# Altium project Projet solar panel.PrjPcb
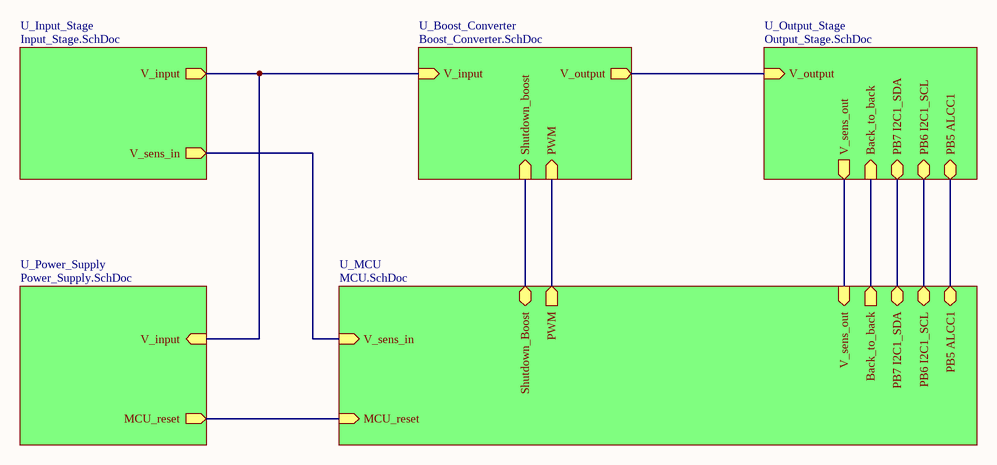
[diagram p0: Main.SchDoc]
6 sheets, 84 parts. Net scope: hierarchical (ports join the sheet entries above them; power ports are global).
Board file: PCB.PcbDoc
Sheets:
  Main.SchDoc
    U_Input_Stage = Input_Stage.SchDoc
    U_Boost_Converter = Boost_Converter.SchDoc
    U_Output_Stage = Output_Stage.SchDoc
    U_Power_Supply = Power_Supply.SchDoc
    U_MCU = MCU.SchDoc

## Sheet Main.SchDoc
size A4; SheetNumber: 1; SheetTotal: 6

### Sub-sheets
U_Boost_Converter = Boost_Converter.SchDoc: PWM (in), V_input (in), Shutdown_boost (in), V_output (out)
U_Input_Stage = Input_Stage.SchDoc: V_sens_in (out), V_input (out)
U_MCU = MCU.SchDoc: PWM (out), V_sens_in (in), Shutdown_Boost (bidir), PB6 I2C1_SCL (bidir), V_sens_out (in), PB7 I2C1_SDA (bidir), MCU_reset (in), PB5 ALCC1 (bidir), Back_to_back (out)
U_Output_Stage = Output_Stage.SchDoc: V_sens_out (out), V_output (in), PB7 I2C1_SDA (bidir), PB6 I2C1_SCL (bidir), PB5 ALCC1 (bidir), Back_to_back (in)
U_Power_Supply = Power_Supply.SchDoc: MCU_reset (out), V_input (in)  | Name: Power_Supply

### Nets
NetC4_2: sheet U_Input_Stage/V_sens_in, sheet U_MCU/V_sens_in
NetC5_1: sheet U_Input_Stage/V_input, sheet U_Boost_Converter/V_input, sheet U_Power_Supply/V_input
NetC23_2: sheet U_Output_Stage/V_sens_out, sheet U_MCU/V_sens_out
NetC24_2: sheet U_Boost_Converter/V_output, sheet U_Output_Stage/V_output
NetIC1_1: sheet U_Boost_Converter/PWM, sheet U_MCU/PWM
NetIC1_2: sheet U_Boost_Converter/Shutdown_boost, sheet U_MCU/Shutdown_Boost
NetIC5_4: sheet U_Output_Stage/PB6 I2C1_SCL, sheet U_MCU/PB6 I2C1_SCL
NetIC5_5: sheet U_Output_Stage/PB7 I2C1_SDA, sheet U_MCU/PB7 I2C1_SDA
NetIC5_6: sheet U_Output_Stage/PB5 ALCC1, sheet U_MCU/PB5 ALCC1
NetJ1_2: sheet U_Power_Supply/MCU_reset, sheet U_MCU/MCU_reset
NetP4_21: sheet U_Output_Stage/Back_to_back, sheet U_MCU/Back_to_back

## Sheet Input_Stage.SchDoc
size A4; SheetNumber: 2; SheetTotal: 6
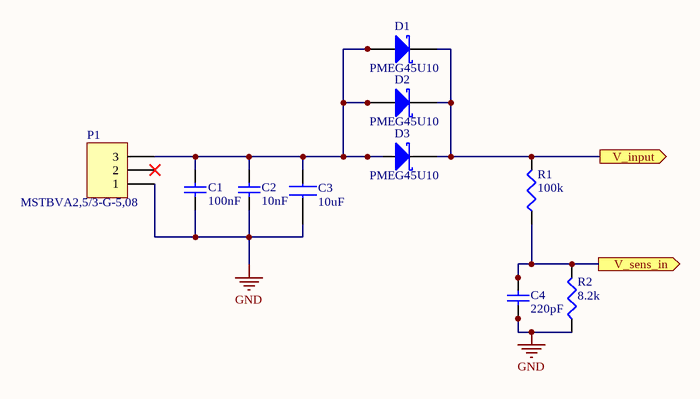
[diagram p1: Input_Stage.SchDoc]

### Parts
C1  value 100nF  [CAPC3216X180N]  (hidden comment: 10nF)
C2  value 10nF  [CAPC3216X180N]  (hidden comment: 100µF)
C3  value 10uF  [CAPC3225X270N]  (hidden comment: GRM32EC72A106KE05K)
C4  220pF  [CAPC3216X180N]
D1  PMEG45U10  [PMEG45U10EPDZ]
D2  PMEG45U10  [PMEG45U10EPDZ]
D3  PMEG45U10  [PMEG45U10EPDZ]
P1  MSTBVA2,5/3-G-5,08  [HDR1X3]
R1  value 100k  [RESC3216X75N]  (hidden comment: 100KΩ)
R2  value 8.2k  [RESC3216X75N]  (hidden comment: 8.2KΩ)

### Ports
V_input (out), V_sens_in (out)

### Nets
GND: C1.1 C2.1 C3.1 C4.1 P1.1 R2.1
NetC1_2: C1.2 C2.2 C3.2 D1.1 D1.2 D2.1 D2.2 D3.1 D3.2 P1.3
NetC4_2: C4.2 R1.1 R2.2 ; port V_sens_in
NetC5_1: D1.3 D2.3 D3.3 R1.2 ; port V_input

Not connected (* = marked no-connect by the designer): P1 2*

### Library data of the parts
C1 = CC1206KKX7R0BB104: Capacitor 100nF; Published: 8-Jun-2000; LatestRevisionDate: 17-Jul-2002; LatestRevisionNote: Re-released for DXP Platform.; PackageReference: RAD-0.3; Publisher: Altium Limited; PackageDescription: Radial Cap, Thru-Hole; 2 Leads; 0.3 in Pin Spacing; Supplier 1: Farnell
C2 = C1206C103K1RACTU: Capacitor 10nF; Published: 8-Jun-2000; LatestRevisionDate: 17-Jul-2002; LatestRevisionNote: Re-released for DXP Platform.; PackageReference: RAD-0.3; Publisher: Altium Limited; PackageDescription: Radial Cap, Thru-Hole; 2 Leads; 0.3 in Pin Spacing; Supplier 1: Mouser
C3 = GRM32EC72A106KE05K: Ceramic capacitor 10uF; Manufacturer_Name: Murata Electronics; Height: 2.7mm; Manufacturer_Part_Number: GRM32EC72A106KE05K; Mouser Part Number: 81-GRM32EC72A106KE5K; Mouser Price/Stock: https://www.mouser.co.uk/ProductDetail/Murata-Electronics/GRM32EC72A106KE05K?qs=rrS6PyfT74e65RehvwNPbw%3D%3D; Arrow Part Number: GRM32EC72A106KE05K; Arrow Price/Stock: https://www.arrow.com/en/products/grm32ec72a106ke05k/murata-manufacturing?region=nac
C4 = VJ1206A221JXBCW1BC: Capacitor 220pF; Published: 8-Jun-2000; LatestRevisionDate: 17-Jul-2002; LatestRevisionNote: Re-released for DXP Platform.; PackageReference: RAD-0.3; Publisher: Altium Limited; PackageDescription: Radial Cap, Thru-Hole; 2 Leads; 0.3 in Pin Spacing; Supplier 1: Mouser; Value: 220pF
D1-D3 = PMEG45U10EPDZ: Schottky Diode; Manufacturer_Name: Nexperia; Datasheet Link: https://assets.nexperia.com/documents/data-sheet/PMEG45U10EPD.pdf; Height: 0.82mm; Manufacturer_Part_Number: PMEG45U10EPDZ; Mouser Part Number: 771-PMEG45U10EPDZ; Mouser Price/Stock: https://www.mouser.co.uk/ProductDetail/Nexperia/PMEG45U10EPDZ?qs=M%2FOdCRO8QQ0v3Dd16sTKSg%3D%3D; Arrow Part Number: PMEG45U10EPDZ; Arrow Price/Stock: https://www.arrow.com/en/products/pmeg45u10epdz/nexperia
P1 = MSTBVA2,5/3-G-5,08: Header, 3-Pin; LatestRevisionDate: 17-Jul-2002; LatestRevisionNote: Re-released for DXP Platform.; Publisher: Altium Limited
R1 = MCWR12X1003FTL: Resistor 100k; Published: 8-Jun-2000; LatestRevisionDate: 29-May-2009; LatestRevisionNote: IPC-7351 Footprint Added.; PackageReference: J1-0603; Publisher: Altium Limited; PackageDescription: Chip Resistor; Supplier 1: Farnell
R2 = CRGCQ1206F8K2: Resistor 8.2k; Published: 8-Jun-2000; LatestRevisionDate: 29-May-2009; LatestRevisionNote: IPC-7351 Footprint Added.; PackageReference: J1-0603; Publisher: Altium Limited; PackageDescription: Chip Resistor; Supplier 1: Mouser

## Sheet Boost_Converter.SchDoc
size A4; SheetNumber: 3; SheetTotal: 6
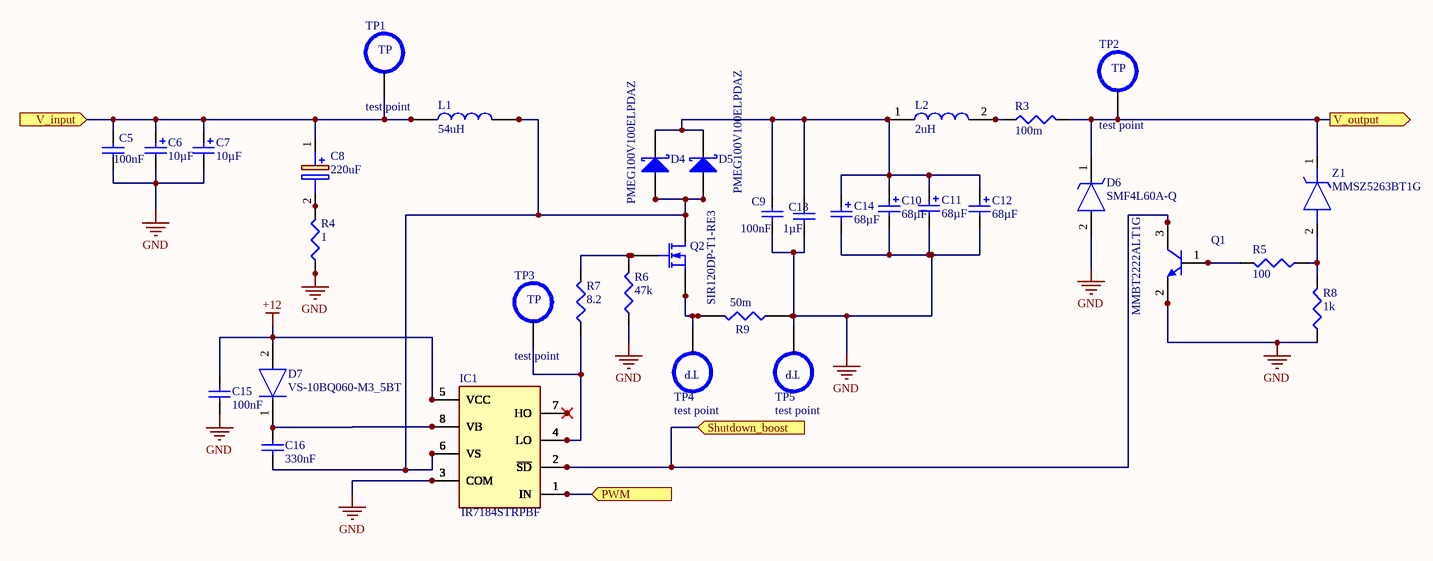
[diagram p2: Boost_Converter.SchDoc]

### Parts
C5  value 100nF  [CAPC3216X180N]  (hidden comment: CC1206KKX7R0BB104)
C6  value 10µF  [870056174001]  (hidden comment: 870056174001)
C7  value 10µF  [870056174001]  (hidden comment: 870056174001)
C8  value 220uF  [CAPPRD500W60D1275H2700]  (hidden comment: 100ZLJ220M12.5X25)
C9  value 100nF  [CAPC3216X180N]  (hidden comment: CC1206KKX7R0BB104)
C10  EGXF251ELL680MK30S: 68µF  [EGXF251ELL680MK30S]  (hidden comment: EGXF251ELL680MK30S)
C11  EGXF251ELL680MK30S: 68µF  [EGXF251ELL680MK30S]  (hidden comment: EGXF251ELL680MK30S)
C12  EGXF251ELL680MK30S: 68µF  [EGXF251ELL680MK30S]  (hidden comment: EGXF251ELL680MK30S)
C13  value 1µF  [CAPC3216X180N]  (hidden comment: C1206C105M5REC7210)
C14  EGXF251ELL680MK30S: 68µF  [EGXF251ELL680MK30S]  (hidden comment: EGXF251ELL680MK30S)
C15  100nF  [CAPC3216X180N]
C16  330nF  [CAPC3216X180N]
D4  PMEG100V100ELPDAZ  [PMEG100V100ELPDAZ]
D5  PMEG100V100ELPDAZ  [PMEG100V100ELPDAZ]
D6  SMF4L60A-Q  [SODFL3716X135N]
D7  VS-10BQ060-M3_5BT  [DIOM5436X244N]
IC1  IR7184STRPBF  [SOIC127P600X175-8N]
L1  value 54uH  [SHBC201R7A0054V]  (hidden comment: SHBC20-1R7A0054V)
L2  value 2uH  [SRP1510CA100M]  (hidden comment: SRP1580CA-2R0M)
Q1  MMBT2222ALT1G  [SOT96P237X111-3N]
Q2  SIR120DP-T1-RE3  [SI7141DPT1GE3]
R3  value 100m  [RESC6331X80N]  (hidden comment: CRM2512-FX-R100ELF)
R4  value 1  [RESC6432X120N]  (hidden comment: 35221R0JT)
R5  value 100  [RESC3216X75N]  (hidden comment: 100Ω)
R6  value 47k  [RESC3216X75N]  (hidden comment: MCWR12X4702FTL)
R7  value 8.2  [RESC3216X75N]  (hidden comment: MCWR12W8R20FTL)
R8  value 1k  [RESC3216X75N]  (hidden comment: 1KΩ)
R9  value 50m  [RESC7146X175N]  (hidden comment: WSHM2818R0500FEB)
TP1  test point  [Test point]
TP2  test point  [Test point]
TP3  test point  [Test point]
TP4  test point  [Test point]
TP5  test point  [Test point]
Z1  MMSZ5263BT1G  [SOD3716X135N]

### Ports
PWM (in), Shutdown_boost (in), V_input (in), V_output (out)

### Nets
+12: C15.2 D7.2(A) IC1.5(VCC)
GND: C5.2 C6.2 C7.2 C9.2 C10.2 C11.2 C12.2 C13.1 C14.2 C15.1 D6.2(A) IC1.3(COM) Q1.2(E) R4.1 R6.1 R8.1 R9.1 TP5.5
NetC5_1: C5.1 C6.1 C7.1 C8.1(+) L1.1 TP1.5 ; port V_input
NetC8_2: C8.2(-) R4.2
NetC9_1: C9.1 C10.1 C11.1 C12.1 C13.2 C14.1 D4.3(K) D5.3(K) L2.1
NetC16_1: C16.1 D4.1(A_1) D4.2(A_2) D5.1(A_1) D5.2(A_2) IC1.6(VS) L1.2 Q2.5(D) Q2.6(D) Q2.7(D) Q2.8(D)
NetC16_2: C16.2 D7.1(K) IC1.8(VB)
NetC24_2: D6.1(K) R3.2 TP2.5 Z1.1(K) ; port V_output
NetIC1_1: IC1.1(IN) ; port PWM
NetIC1_2: IC1.2(~{SD}) Q1.3(C) ; port Shutdown_boost
NetIC1_4: IC1.4(LO) R7.1 TP3.5
NetL2_2: L2.2 R3.1
NetQ1_1: Q1.1(B) R5.2
NetQ2_1: Q2.1(G) R6.2 R7.2
NetQ2_2: Q2.2(S) Q2.3(S) Q2.4(S) R9.2 TP4.5
NetR5_1: R5.1 R8.2 Z1.2(A)

Not connected (* = marked no-connect by the designer): IC1 7(HO)*

### Notes on the sheet
- (in symbol test point) TP

### Library data of the parts
C5 C9 C15 = CC1206KKX7R0BB104: Capacitor 100nF; Published: 8-Jun-2000; LatestRevisionDate: 17-Jul-2002; LatestRevisionNote: Re-released for DXP Platform.; PackageReference: RAD-0.3; Publisher: Altium Limited; PackageDescription: Radial Cap, Thru-Hole; 2 Leads; 0.3 in Pin Spacing; Supplier 1: Farnell
  C15: Value: 100nF
C6 C7 = 870056174001: Capacitor Polarised 10uF; Manufacturer_Name: Panasonic; Manufacturer_Part_Number: EEV-FK1K101V; Datasheet Link: http://industrial.panasonic.com/cdbs/www-data/pdf/RDE0000/ABA0000C1181.pdf; Height: 14.3mm; Mouser Part Number: 667-EEV-FK1K101V; Mouser Price/Stock: https://www.mouser.co.uk/ProductDetail/Panasonic/EEV-FK1K101V?qs=MtOUKumLmnbTFvRMlB7%2FdA%3D%3D
C8 = 100ZLJ220M12.5X25: Capacitor Polarised; Manufacturer_Name: Rubycon; Datasheet Link: https://componentsearchengine.com/Datasheets/2/100ZLJ220M12.5X25.pdf; Height: 27mm; Manufacturer_Part_Number: 100ZLJ220M12.5X25; Mouser Part Number: 232-100ZLJ220M125X25; Mouser Price/Stock: https://www.mouser.com/Search/Refine.aspx?Keyword=232-100ZLJ220M125X25; Arrow Part Number: 100ZLJ220M12.5X25; Arrow Price/Stock: https://www.arrow.com/en/products/100zlj220m12.5x25/rubycon
C10-C12 C14 = EGXF251ELL680MK30S: Capacitor 68uF; Manufacturer_Name: Panasonic; Manufacturer_Part_Number: EEV-FK1K101V; Value: 68µF; Datasheet Link: http://industrial.panasonic.com/cdbs/www-data/pdf/RDE0000/ABA0000C1181.pdf; Height: 14.3mm; Mouser Part Number: 667-EEV-FK1K101V; Mouser Price/Stock: https://www.mouser.co.uk/ProductDetail/Panasonic/EEV-FK1K101V?qs=MtOUKumLmnbTFvRMlB7%2FdA%3D%3D
C13 = C1206C105M5REC7210: Capacitor 1uF; Published: 8-Jun-2000; LatestRevisionDate: 17-Jul-2002; LatestRevisionNote: Re-released for DXP Platform.; PackageReference: RAD-0.3; Publisher: Altium Limited; PackageDescription: Radial Cap, Thru-Hole; 2 Leads; 0.3 in Pin Spacing; Supplier 1: Farnell
C16 = C3216X7R2A334K130AA: Capacitor 330nF; Published: 8-Jun-2000; LatestRevisionDate: 17-Jul-2002; LatestRevisionNote: Re-released for DXP Platform.; PackageReference: RAD-0.3; Publisher: Altium Limited; PackageDescription: Radial Cap, Thru-Hole; 2 Leads; 0.3 in Pin Spacing; Supplier 1: Mouser; Value: 330nF
D4 D5 = PMEG100V100ELPDAZ: Diode; Manufacturer_Name: Nexperia; Datasheet Link: https://assets.nexperia.com/documents/data-sheet/PMEG100V100ELPD.pdf; Height: 0.82mm; Manufacturer_Part_Number: PMEG100V100ELPDAZ; Mouser Part Number: 771-MEG100V100ELPDAZ; Mouser Price/Stock: https://www.mouser.co.uk/ProductDetail/Nexperia/PMEG100V100ELPDAZ?qs=64Y9EYqwa9iK90zZrx4xYg%3D%3D; Arrow Part Number: PMEG100V100ELPDAZ; Arrow Price/Stock: https://www.arrow.com/en/products/pmeg100v100elpdaz/nexperia
D6 = SMF4L60A-Q: TVS Diode (Uni-directional); Manufacturer_Name: Bourns; Datasheet Link: https://bourns.com/docs/product-datasheets/smf4l-q.pdf; Height: 1.35mm; Manufacturer_Part_Number: SMF4L60A-Q; Mouser Part Number: 652-SMF4L60A-Q; Mouser Price/Stock: https://www.mouser.co.uk/ProductDetail/Bourns/SMF4L60A-Q?qs=iLbezkQI%252BsjmazDMS%252BOglQ%3D%3D
D7 = VS-10BQ060-M3_5BT: Diode; Manufacturer_Name: Vishay; Manufacturer_Part_Number: VS-10BQ060-M3/5BT; Datasheet Link: https://componentsearchengine.com/Datasheets/1/VS-10BQ060-M3_5BT.pdf; Height: 2.44mm; Mouser Part Number: 78-VS-10BQ060-M35BT; Mouser Price/Stock: https://www.mouser.co.uk/ProductDetail/Vishay-Semiconductors/VS-10BQ060-M3-5BT/?qs=asPD7ZL2j3Xpjq4X%2F1O06Q%3D%3D; Arrow Part Number: VS-10BQ060-M3/5BT; Arrow Price/Stock: https://www.arrow.com/en/products/vs-10bq060-m35bt/vishay
IC1 = IR7184STRPBF: Integrated Circuit; Manufacturer_Name: Infineon; Datasheet Link: https://componentsearchengine.com/Datasheets/1/IR7184STRPBF.pdf; Height: 1.75mm; Manufacturer_Part_Number: IR7184STRPBF; Mouser Part Number: 942-IR7184STRPBF; Mouser Price/Stock: https://www.mouser.com/Search/Refine.aspx?Keyword=942-IR7184STRPBF; Arrow Part Number: IR7184STRPBF; Arrow Price/Stock: https://www.arrow.com/en/products/ir7184strpbf/infineon-technologies-ag
L1 = SHBC20-1R7A0054V: Inductor 54uH
L2 = SRP1580CA-2R0M: Inductor 2uH; Manufacturer_Name: Bourns; Manufacturer_Part_Number: SRP1038C-100M; Datasheet Link: https://www.bourns.com/data/global/pdfs/SRP1038A.pdf; Height: 4mm; Mouser Part Number: 652-SRP1038C-100M; Mouser Price/Stock: https://www.mouser.co.uk/ProductDetail/Bourns/SRP1038C-100M?qs=PzGy0jfpSMvAa%252BP05u%252BK2w%3D%3D; Arrow Part Number: SRP1038C-100M; Arrow Price/Stock: https://www.arrow.com/en/products/srp1038c-100m/bourns
Q1 = MMBT2222ALT1G: NPN transistor; Manufacturer_Name: ON Semiconductor; Datasheet Link: http://www.onsemi.com/pub/Collateral/MMBT2222LT1-D.PDF; Height: 1.11mm; Manufacturer_Part_Number: MMBT2222ALT1G; Mouser Part Number: 863-MMBT2222ALT1G; Mouser Price/Stock: https://www.mouser.co.uk/ProductDetail/onsemi/MMBT2222ALT1G?qs=HVbQlW5zcXWwnD7Jokybqg%3D%3D; Arrow Part Number: MMBT2222ALT1G; Arrow Price/Stock: https://www.arrow.com/en/products/mmbt2222alt1g/on-semiconductor
Q2 = SIR120DP-T1-RE3: MOSFET (N-Channel); Manufacturer_Name: Vishay; Datasheet Link: http://www.vishay.com/docs/79731/sir120dp.pdf; Manufacturer_Part_Number: SIR120DP-T1-RE3; Mouser Part Number: 78-SIR120DP-T1-RE3; Mouser Price/Stock: https://www.mouser.co.uk/ProductDetail/Vishay-Semiconductors/SIR120DP-T1-RE3?qs=UkDUCjYnTB3xEXzKpvDZuA%3D%3D; Arrow Part Number: SIR120DP-T1-RE3; Arrow Price/Stock: https://www.arrow.com/en/products/sir120dp-t1-re3/vishay
R3 = CRM2512-FX-R100ELF: Resistor 100m; Published: 8-Jun-2000; LatestRevisionDate: 29-May-2009; LatestRevisionNote: IPC-7351 Footprint Added.; PackageReference: J1-0603; Publisher: Altium Limited; PackageDescription: Chip Resistor; Supplier 1: Mouser
R4 = 35221R0JT: Resistor 1 3W; Published: 8-Jun-2000; LatestRevisionDate: 29-May-2009; LatestRevisionNote: IPC-7351 Footprint Added.; PackageReference: J1-0603; Publisher: Altium Limited; PackageDescription: Chip Resistor; Supplier 1: Farnell
R5 = MCWR12X1000FTL: Resistor 100; Published: 8-Jun-2000; LatestRevisionDate: 29-May-2009; LatestRevisionNote: IPC-7351 Footprint Added.; PackageReference: J1-0603; Publisher: Altium Limited; PackageDescription: Chip Resistor; Supplier 1: Farnell
R6 = MCWR12X4702FTL: Resistor 47k; Published: 8-Jun-2000; LatestRevisionDate: 29-May-2009; LatestRevisionNote: IPC-7351 Footprint Added.; PackageReference: J1-0603; Publisher: Altium Limited; PackageDescription: Chip Resistor; supplier: farnell
R7 = MCWR12W8R20FTL: Resistor 8.2; Published: 8-Jun-2000; LatestRevisionDate: 29-May-2009; LatestRevisionNote: IPC-7351 Footprint Added.; PackageReference: J1-0603; Publisher: Altium Limited; PackageDescription: Chip Resistor; Supplier 1: Farnell
R8 = MCHP06W2F1001T5E: Resistor 1k; Published: 8-Jun-2000; LatestRevisionDate: 29-May-2009; LatestRevisionNote: IPC-7351 Footprint Added.; PackageReference: J1-0603; Publisher: Altium Limited; PackageDescription: Chip Resistor; supplier: farnell; Supplier 1: Farnell
R9 = WSHM2818R0500FEB: Resistor 50m; Manufacturer_Name: Vishay; Datasheet Link: https://componentsearchengine.com/Datasheets/2/WSHM2818R0500FEB.pdf; Height: 1.75mm; Manufacturer_Part_Number: WSHM2818R0500FEB; Mouser Part Number: 71-WSHM2818R0500FEB; Mouser Price/Stock: https://www.mouser.com/Search/Refine.aspx?Keyword=71-WSHM2818R0500FEB
Z1 = MMSZ5263BT1G: Zener Diode; Manufacturer_Name: ON Semiconductor; Datasheet Link: http://www.onsemi.com/pub/Collateral/MMSZ5221BT1-D.PDF; Height: 1.35mm; Manufacturer_Part_Number: MMSZ5263BT1G; Mouser Part Number: 863-MMSZ5263BT1G; Mouser Price/Stock: https://www.mouser.co.uk/ProductDetail/onsemi/MMSZ5263BT1G?qs=ZpPixqFcBtxaamSEBIiIIg%3D%3D; Arrow Part Number: MMSZ5263BT1G; Arrow Price/Stock: https://www.arrow.com/en/products/mmsz5263bt1g/on-semiconductor?region=nac

## Sheet Output_Stage.SchDoc
size A4; SheetNumber: 5; SheetTotal: 6
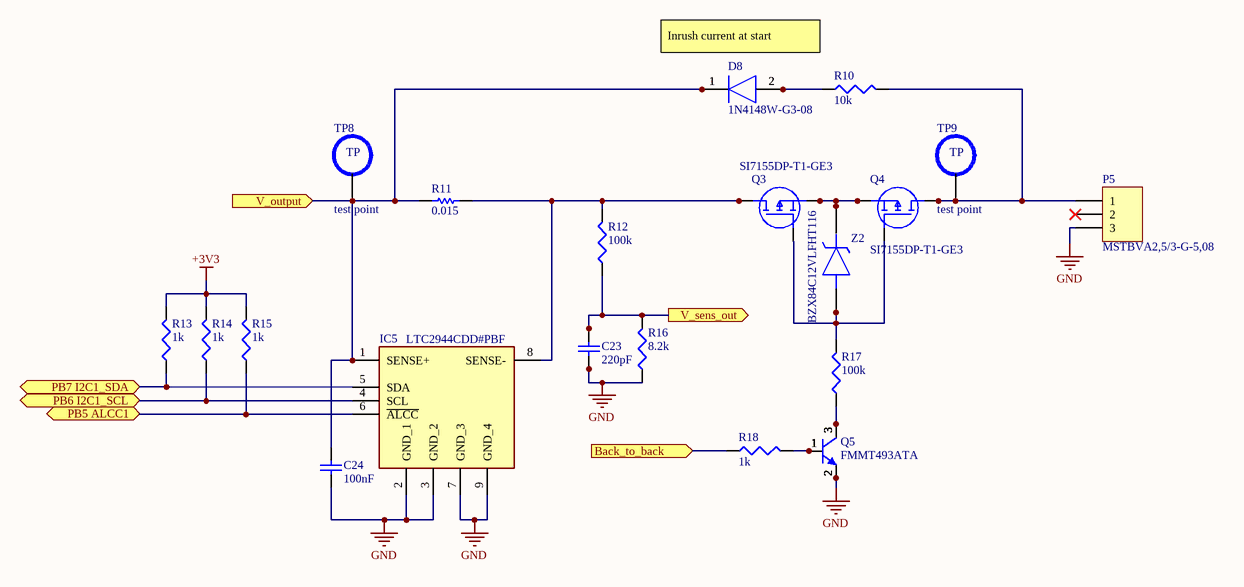
[diagram p3: Output_Stage.SchDoc]

### Parts
C23  220pF  [CAPC3216X180N]
C24  value 100nF  [CAPC3216X180N]  (hidden comment: CC1206KKX7R0BB104)
D8  1N4148W-G3-08  [SOD3716X135N]
IC5  LTC2944CDD#PBF  [SON50P300X300X80-9N-D]
P5  MSTBVA2,5/3-G-5,08  [HDR1X3]
Q3  SI7155DP-T1-GE3  [SI7141DPT1GE3]
Q4  SI7155DP-T1-GE3  [SI7141DPT1GE3]
Q5  FMMT493ATA  [SOT95P230X110-3N]
R10  value 10k  [RESC3216X75N]  (hidden comment: MCWR12X1002FTL)
R11  value 0.015  [RESC3216X75N]  (hidden comment: ERJ8BWFR015V)
R12  value 100k  [RESC3216X75N]  (hidden comment: 100KΩ)
R13  value 1k  [RESC3216X75N]  (hidden comment: MCHP06W2F1001T5E)
R14  value 1k  [RESC3216X75N]  (hidden comment: MCHP06W2F1001T5E)
R15  value 1k  [RESC3216X75N]  (hidden comment: MCHP06W2F1001T5E)
R16  value 8.2k  [RESC3216X75N]  (hidden comment: 8.2KΩ)
R17  value 100k  [RESC3216X75N]  (hidden comment: MCWR12X1003FTL)
R18  value 1k  [RESC3216X75N]  (hidden comment: MCHP06W2F1001T5E)
TP8  test point  [Test point]
TP9  test point  [Test point]
Z2  BZX84C12VLFHT116  [SOT95P240X115-3N]

### Ports
Back_to_back (in), PB5 ALCC1 (bidir), PB6 I2C1_SCL (bidir), PB7 I2C1_SDA (bidir), V_output (in), V_sens_out (out)

### Nets
+3V3: R13.2 R14.2 R15.2
GND: C23.1 C24.1 IC5.2(GND_1) IC5.3(GND_2) IC5.7(GND_3) IC5.9(GND_4) P5.3 Q5.2(E) R16.1
NetC23_2: C23.2 R12.1 R16.2 ; port V_sens_out
NetC24_2: C24.2 D8.1(K) IC5.1(SENSE+) R11.1 TP8.5 ; port V_output
NetD8_2: D8.2(A) R10.1
NetIC5_4: IC5.4(SCL) R14.1 ; port PB6 I2C1_SCL
NetIC5_5: IC5.5(SDA) R13.1 ; port PB7 I2C1_SDA
NetIC5_6: IC5.6(~{ALCC}) R15.1 ; port PB5 ALCC1
NetIC5_8: IC5.8(SENSE-) Q3.5(D) Q3.6(D) Q3.7(D) Q3.8(D) R11.2 R12.2
NetP4_21: R18.1 ; port Back_to_back
NetP5_1: P5.1 Q4.5(D) Q4.6(D) Q4.7(D) Q4.8(D) R10.2 TP9.5
NetQ3_1: Q3.1(G) Q4.1(G) R17.2 Z2.1(A) Z2.2(A)
NetQ3_2: Q3.2(S) Q3.3(S) Q3.4(S) Q4.2(S) Q4.3(S) Q4.4(S) Z2.3(K)
NetQ5_1: Q5.1(B) R18.2
NetQ5_3: Q5.3(C) R17.1

Not connected (* = marked no-connect by the designer): P5 2*

### Notes on the sheet
- Inrush current at start
- (in symbol test point) TP

### Library data of the parts
C23 = VJ1206A221JXBCW1BC: Capacitor 220pF; Published: 8-Jun-2000; LatestRevisionDate: 17-Jul-2002; LatestRevisionNote: Re-released for DXP Platform.; PackageReference: RAD-0.3; Publisher: Altium Limited; PackageDescription: Radial Cap, Thru-Hole; 2 Leads; 0.3 in Pin Spacing; Supplier 1: Mouser; Value: 220pF
C24 = CC1206KKX7R0BB104: Capacitor 100nF; Published: 8-Jun-2000; LatestRevisionDate: 17-Jul-2002; LatestRevisionNote: Re-released for DXP Platform.; PackageReference: RAD-0.3; Publisher: Altium Limited; PackageDescription: Radial Cap, Thru-Hole; 2 Leads; 0.3 in Pin Spacing; Supplier 1: Farnell
D8 = 1N4148W-G3-08: Diode; Manufacturer_Name: Vishay; Datasheet Link: https://componentsearchengine.com/Datasheets/1/1N4148W-G3-08.pdf; Height: 1.35mm; Manufacturer_Part_Number: 1N4148W-G3-08; Mouser Part Number: 78-1N4148W-G3-08; Mouser Price/Stock: https://www.mouser.co.uk/ProductDetail/Vishay-Semiconductors/1N4148W-G3-08?qs=uS%252BVSIFnvp46StDBB15x4Q%3D%3D; Arrow Part Number: 1N4148W-G3-08; Arrow Price/Stock: https://www.arrow.com/en/products/1n4148w-g3-08/vishay
IC5 = LTC2944CDD#PBF: Integrated Circuit; Manufacturer_Name: Analog Devices; Datasheet Link: https://www.analog.com/media/en/technical-documentation/data-sheets/2944fa.pdf; Height: 0.8mm; Manufacturer_Part_Number: LTC2944CDD#PBF; Mouser Part Number: 584-LTC2944CDDPBF; Mouser Price/Stock: https://www.mouser.co.uk/ProductDetail/Analog-Devices/LTC2944CDDPBF?qs=u4fy%2FsgLU9Omd44j%252B6inEQ%3D%3D; Arrow Part Number: LTC2944CDD#PBF; Arrow Price/Stock: https://www.arrow.com/en/products/ltc2944cddpbf/analog-devices
P5 = MSTBVA2,5/3-G-5,08: Header, 3-Pin; LatestRevisionDate: 17-Jul-2002; LatestRevisionNote: Re-released for DXP Platform.; Publisher: Altium Limited
Q3 Q4 = SI7155DP-T1-GE3: MOSFET (P-Channel)
Q5 = FMMT493ATA: Transistor BJT PNP; Manufacturer_Name: Diodes Inc.; Datasheet Link: https://datasheet.datasheetarchive.com/originals/distributors/Datasheets_SAMA/813f9dcbae48594177f25ecf9038d058.pdf; Height: 1.1mm; Manufacturer_Part_Number: FMMT493ATA; Mouser Part Number: 522-FMMT493ATA; Mouser Price/Stock: https://www.mouser.co.uk/ProductDetail/Diodes-Incorporated/FMMT493ATA?qs=GBLSl2AkiruoD9OMdIH%252BaQ%3D%3D; Arrow Part Number: FMMT493ATA; Arrow Price/Stock: https://www.arrow.com/en/products/fmmt493ata/diodes-incorporated
R10 = MCWR12X1002FTL: Resistor 10k; Published: 8-Jun-2000; LatestRevisionDate: 29-May-2009; LatestRevisionNote: IPC-7351 Footprint Added.; PackageReference: J1-0603; Publisher: Altium Limited; PackageDescription: Chip Resistor; Supplier 1: Farnell
R11 = ERJ8BWFR015V: Shunt resistor 0.015; Published: 8-Jun-2000; LatestRevisionDate: 17-Jul-2002; LatestRevisionNote: Re-released for DXP Platform.; PackageReference: AXIAL-0.3; Publisher: Altium Limited; PackageDescription: Axial Device, Thru-Hole; 2 Leads; 0.3 in Pin Spacing; Supplier 1: Mouser
R12 R17 = MCWR12X1003FTL: Resistor 100k; Published: 8-Jun-2000; LatestRevisionDate: 29-May-2009; LatestRevisionNote: IPC-7351 Footprint Added.; PackageReference: J1-0603; Publisher: Altium Limited; PackageDescription: Chip Resistor; Supplier 1: Farnell
R13-R15 R18 = MCHP06W2F1001T5E: Resistor 1k; Published: 8-Jun-2000; LatestRevisionDate: 29-May-2009; LatestRevisionNote: IPC-7351 Footprint Added.; PackageReference: J1-0603; Publisher: Altium Limited; PackageDescription: Chip Resistor; supplier: farnell; Supplier 1: Farnell
R16 = CRGCQ1206F8K2: Resistor 8.2k; Published: 8-Jun-2000; LatestRevisionDate: 29-May-2009; LatestRevisionNote: IPC-7351 Footprint Added.; PackageReference: J1-0603; Publisher: Altium Limited; PackageDescription: Chip Resistor; Supplier 1: Mouser
Z2 = BZX84C12VLFHT116: Zener Diode

## Sheet Power_Supply.SchDoc
size A4; SheetNumber: 4; SheetTotal: 6
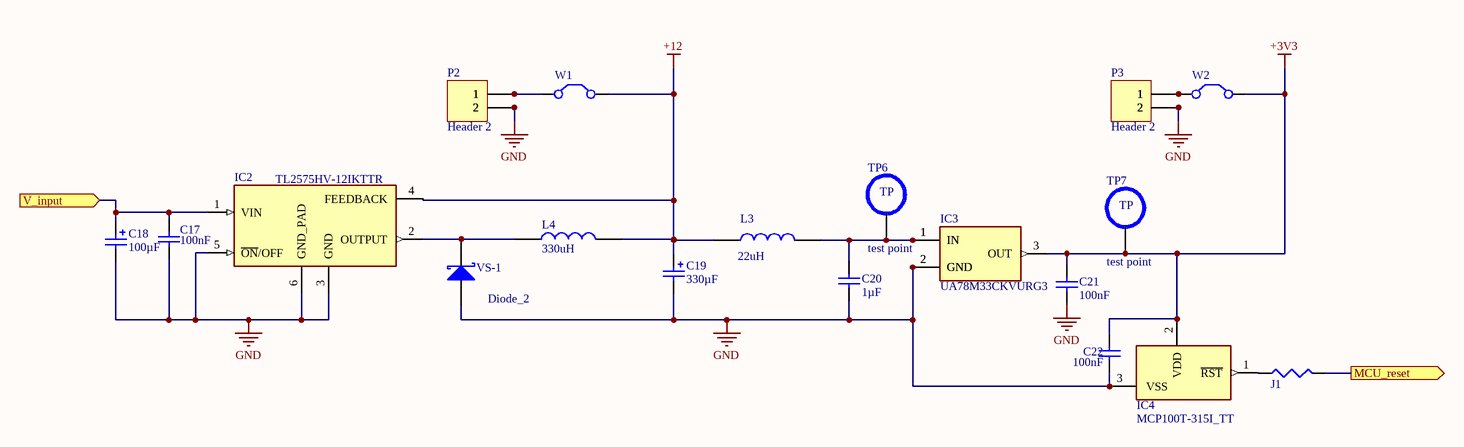
[diagram p4: Power_Supply.SchDoc]

### Parts
C17  value 100nF  [CAPC3216X180N]  (hidden comment: CC1206KKX7R0BB104)
C18  value 100µF  [EEEFK0J332AV]  (hidden comment: EEV-FK1K101V)
C19  value 330µF  [EEE0JA471UAP]  (hidden comment: EEEFK1E331P)
C20  value 1µF  [CAPC3216X180N]  (hidden comment: C1206C105M5REC7210)
C21  value 100nF  [CAPC3216X180N]  (hidden comment: CC1206KKX7R0BB104)
C22  value 100nF  [CAPC3216X180N]  (hidden comment: CC1206KKX7R0BB104)
IC2  TL2575HV-12IKTTR  [TO170P1524X483-6N]
IC3  UA78M33CKVURG3  [TPS7A6533QKVURQ1]
IC4  MCP100T-315I_TT  [SOT96P237X112-3N]
J1  MCWR12X000 PTL  [RESC3216X75N]  (value not drawn)
L3  22uH  [INDPM6965X300N]
L4  330uH  [WE-PD_7332/7345_PLASTIC_BASE54]
P2  Header 2  [HDR1X2]
P3  Header 2  [HDR1X2]
TP6  test point  [Test point]
TP7  test point  [Test point]
VS-1  Diode_2  [DIOM5436X244N]
W1  Jumper  [RAD-0.2]  (value not drawn)
W2  Jumper  [RAD-0.2]  (value not drawn)

### Ports
MCU_reset (out), V_input (in)

### Nets
+3V3: C21.2 C22.2 IC3.3(OUT) IC4.2(VDD) TP7.5 W2.2(C2)
+12: C19.1 IC2.4(FEEDBACK) L3.1 L4.2 W1.2(C2)
GND: C17.1 C18.2 C19.2 C20.1 C21.1 C22.1 IC2.3(GND) IC2.5(~{ON}/OFF) IC2.6(GND_PAD) IC3.2(GND) IC4.3(VSS) P2.2 P3.2 VS-1.2(A)
NetC5_1: C17.2 C18.1 IC2.1(VIN) ; port V_input
NetC20_2: C20.2 IC3.1(IN) L3.2 TP6.5
NetIC2_2: IC2.2(OUTPUT) L4.1 VS-1.1(K)
NetIC4_1: IC4.1(~{RST}) J1.1
NetJ1_2: J1.2 ; port MCU_reset
NetP2_1: P2.1 W1.1(C1)
NetP3_1: P3.1 W2.1(C1)

### Notes on the sheet
- (in symbol test point) TP

### Library data of the parts
C17 C21 C22 = CC1206KKX7R0BB104: Capacitor 100nF; Published: 8-Jun-2000; LatestRevisionDate: 17-Jul-2002; LatestRevisionNote: Re-released for DXP Platform.; PackageReference: RAD-0.3; Publisher: Altium Limited; PackageDescription: Radial Cap, Thru-Hole; 2 Leads; 0.3 in Pin Spacing; Supplier 1: Farnell
C18 = EEV-FK1K101V: Capacitor 100uF; Manufacturer_Name: Panasonic; Datasheet Link: http://industrial.panasonic.com/cdbs/www-data/pdf/RDE0000/ABA0000C1181.pdf; Height: 14.3mm; Manufacturer_Part_Number: EEV-FK1K101V; Mouser Part Number: 667-EEV-FK1K101V; Mouser Price/Stock: https://www.mouser.co.uk/ProductDetail/Panasonic/EEV-FK1K101V?qs=MtOUKumLmnbTFvRMlB7%2FdA%3D%3D; Supplier 1: Mouser
C19 = EEEFK1E331P: Capacitor 330uF; Manufacturer_Name: Panasonic; Manufacturer_Part_Number: EEV-FK1K101V; Datasheet Link: http://industrial.panasonic.com/cdbs/www-data/pdf/RDE0000/ABA0000C1181.pdf; Height: 14.3mm; Mouser Part Number: 667-EEV-FK1K101V; Mouser Price/Stock: https://www.mouser.co.uk/ProductDetail/Panasonic/EEV-FK1K101V?qs=MtOUKumLmnbTFvRMlB7%2FdA%3D%3D; Supplier 1: Mouser
C20 = C1206C105M5REC7210: Capacitor 1uF; Published: 8-Jun-2000; LatestRevisionDate: 17-Jul-2002; LatestRevisionNote: Re-released for DXP Platform.; PackageReference: RAD-0.3; Publisher: Altium Limited; PackageDescription: Radial Cap, Thru-Hole; 2 Leads; 0.3 in Pin Spacing; Supplier 1: Farnell
IC2 = TL2575HV-12IKTTR: Integrated Circuit; Manufacturer_Name: Texas Instruments; Datasheet Link: http://www.ti.com/lit/ds/symlink/tl2575-15.pdf; Height: 5.13mm; Manufacturer_Part_Number: TL2575HV-12IKTTR; Mouser Part Number: 595-TL2575HV-12IKTTR; Mouser Price/Stock: https://www.mouser.co.uk/ProductDetail/Texas-Instruments/TL2575HV-12IKTTR?qs=EnLMdcWnKADDmW7d51Om1g%3D%3D; Arrow Part Number: TL2575HV-12IKTTR; Arrow Price/Stock: https://www.arrow.com/en/products/tl2575hv-12ikttr/texas-instruments?region=nac
IC3 = UA78M33CKVURG3: Integrated Circuit; Manufacturer_Name: Texas Instruments; Datasheet Link: https://www.ti.com/lit/gpn/ua78m?HQS=ti-null-null-sf-df-pf-sep-wwe&DCM=yes; Height: 2.52mm; Manufacturer_Part_Number: UA78M33CKVURG3; Mouser Part Number: 595-UA78M33CKVURG3; Mouser Price/Stock: https://www.mouser.co.uk/ProductDetail/Texas-Instruments/UA78M33CKVURG3?qs=0O%2FZFlpUpJXrDg4gfD1Q2g%3D%3D; Arrow Part Number: UA78M33CKVURG3; Arrow Price/Stock: https://www.arrow.com/en/products/ua78m33ckvurg3/texas-instruments
IC4 = MCP100T-315I_TT: Integrated Circuit; Manufacturer_Name: Microchip; Manufacturer_Part_Number: MCP100T-315I/TT; Datasheet Link: http://docs-emea.rs-online.com/webdocs/0d03/0900766b80d034b8.pdf; Height: 1.12mm; Mouser Part Number: 579-MCP100T-315I/TT; Mouser Price/Stock: https://www.mouser.co.uk/ProductDetail/Microchip-Technology/MCP100T-315I-TT?qs=cQYLKLPzRJnnE4Sa6znIFg%3D%3D; Arrow Part Number: MCP100T-315I/TT; Arrow Price/Stock: https://www.arrow.com/en/products/mcp100t-315itt/microchip-technology?region=nac
J1 = MCWR12X000 PTL: Zero ohm resistor; Value: 0
L3 = IHLP2525CZER220M11: Inductor 22uH; Manufacturer_Name: Vishay; Datasheet Link: https://componentsearchengine.com/Datasheets/1/IHLP2525CZER220M11.pdf; Height: 3mm; Manufacturer_Part_Number: IHLP2525CZER220M11; Mouser Part Number: 70-IHLP2525CZER220; Mouser Price/Stock: https://www.mouser.co.uk/ProductDetail/Vishay-Dale/IHLP2525CZER220M11?qs=sy7P%252B1cA09hqmhD2Kelr6g%3D%3D; Arrow Part Number: IHLP2525CZER220M11; Arrow Price/Stock: https://www.arrow.com/en/products/ihlp2525czer220m11/vishay?region=europe; Value: 22uH
L4 = 7447789233: Inductor 330uH; Manufacturer_Name: Wurth Elektronik; Manufacturer_Part_Number: 7447789233
P2 P3 = Header 2: Header, 2-Pin; LatestRevisionDate: 17-Jul-2002; LatestRevisionNote: Re-released for DXP Platform.; Publisher: Altium Limited
VS-1 = Diode_2: Schottky Rectifier / VS-10BQ060-M3/5BT; Note: Terminal 2 is the TAB and is electrically connected to the cathode; Published: 8-Jun-2000; LatestRevisionDate: 17-Jul-2002; LatestRevisionNote: Re-released for DXP Platform.; DatasheetVersion: PD-2.057B; PackageVersion: Feb-1998; PackageReference: TO-220AC; Publisher: Altium Limited; PackageDescription: TO, Thru-Hole, Vertical, Heatsink Mounted; 3 In-Line Leads (1 Absent); Pitch 2.54 mm; ComponentLink1Description: Manufacturer Link; ComponentLink1URL: http://www.irf.com/; ComponentLink2Description: Datasheet; ComponentLink2URL: http://www.irf.com/product-info/datasheets/data/10tq.pdf
W1 W2 = Jumper: Jumper Wire; Published: 24-Mar-1999; LatestRevisionDate: 17-Jul-2002; LatestRevisionNote: Re-released for DXP Platform.; PackageReference: RAD-0.2; Publisher: Altium Limited; PackageDescription: Radial Cap, Thru-Hole; 2 Leads; 0.2 in Pin Spacing

## Sheet MCU.SchDoc
size A4; SheetNumber: 6; SheetTotal: 6
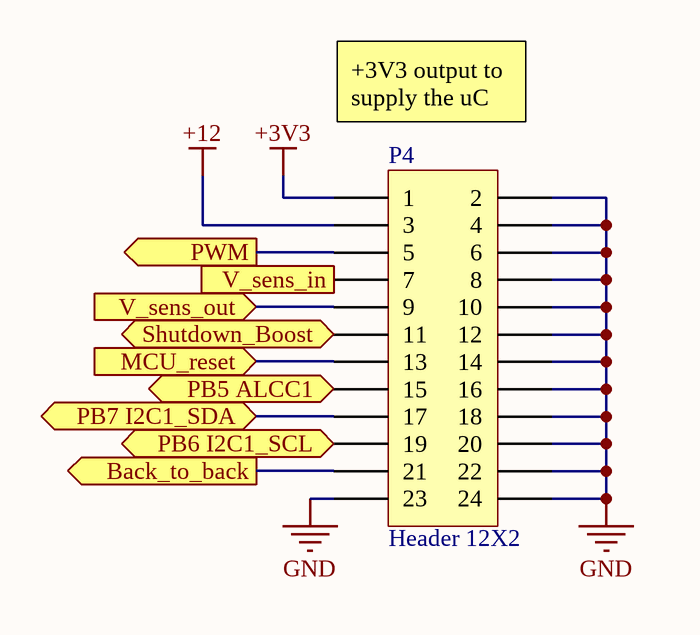
[diagram p5: MCU.SchDoc]

### Parts
P4  Header 12X2  [HDR2X12]

### Ports
Back_to_back (out), MCU_reset (in), PB5 ALCC1 (bidir), PB6 I2C1_SCL (bidir), PB7 I2C1_SDA (bidir), PWM (out), Shutdown_Boost (bidir), V_sens_in (in), V_sens_out (in)

### Nets
+3V3: P4.1
+12: P4.3
GND: P4.2 P4.4 P4.6 P4.8 P4.10 P4.12 P4.14 P4.16 P4.18 P4.20 P4.22 P4.23 P4.24
NetC4_2: P4.7 ; port V_sens_in
NetC23_2: P4.9 ; port V_sens_out
NetIC1_1: P4.5 ; port PWM
NetIC1_2: P4.11 ; port Shutdown_Boost
NetIC5_4: P4.19 ; port PB6 I2C1_SCL
NetIC5_5: P4.17 ; port PB7 I2C1_SDA
NetIC5_6: P4.15 ; port PB5 ALCC1
NetJ1_2: P4.13 ; port MCU_reset
NetP4_21: P4.21 ; port Back_to_back

### Notes on the sheet
- (near P4) +3V3 output to supply the uC

### Library data of the parts
P4 = Header 12X2: Header, 12-Pin, Dual row; LatestRevisionDate: 17-Jul-2002; LatestRevisionNote: Re-released for DXP Platform.; Publisher: Altium Limited

## Nets that join several sheets
+3V3: Output_Stage (R13.2 R14.2 R15.2), Power_Supply (6 pins), MCU (P4.1)
+12: Boost_Converter (C15.2 D7.2 IC1.5), Power_Supply (5 pins), MCU (P4.3)
GND: Input_Stage (6 pins), Boost_Converter (18 pins), Output_Stage (9 pins), Power_Supply (14 pins), MCU (13 pins)
NetC4_2: Input_Stage (C4.2 R1.1 R2.2), MCU (P4.7)
NetC5_1: Input_Stage (D1.3 D2.3 D3.3 R1.2), Boost_Converter (6 pins), Power_Supply (C17.2 C18.1 IC2.1)
NetC23_2: Output_Stage (C23.2 R12.1 R16.2), MCU (P4.9)
NetC24_2: Boost_Converter (D6.1 R3.2 TP2.5 Z1.1), Output_Stage (5 pins)
NetIC1_1: Boost_Converter (IC1.1), MCU (P4.5)
NetIC1_2: Boost_Converter (IC1.2 Q1.3), MCU (P4.11)
NetIC5_4: Output_Stage (IC5.4 R14.1), MCU (P4.19)
NetIC5_5: Output_Stage (IC5.5 R13.1), MCU (P4.17)
NetIC5_6: Output_Stage (IC5.6 R15.1), MCU (P4.15)
NetJ1_2: Power_Supply (J1.2), MCU (P4.13)
NetP4_21: Output_Stage (R18.1), MCU (P4.21)